# Altium schematic sheet CPU_ETH.SchDoc: Title
size 420 x 297 mm; Author: G.Kasprowicz; CompanyName: WUT ISE; DrawnBy: G.Kasprowicz; Organization: WUT ISE; Address1: PW ISE; Address2: Nowowiejska 15/19 00-665 Warsaw; Address3: gkasprow@gmail.com; DocumentNumber: 4; Revision: 2; SheetNumber: 4; SheetTotal: 18; ModifiedBy: -; CheckedDate: -; Title2: Title 2; DivGrp: WUT ISE; Designer: G.Kasprowicz; ModifiedDate: -; ProjectName: Sensor Box
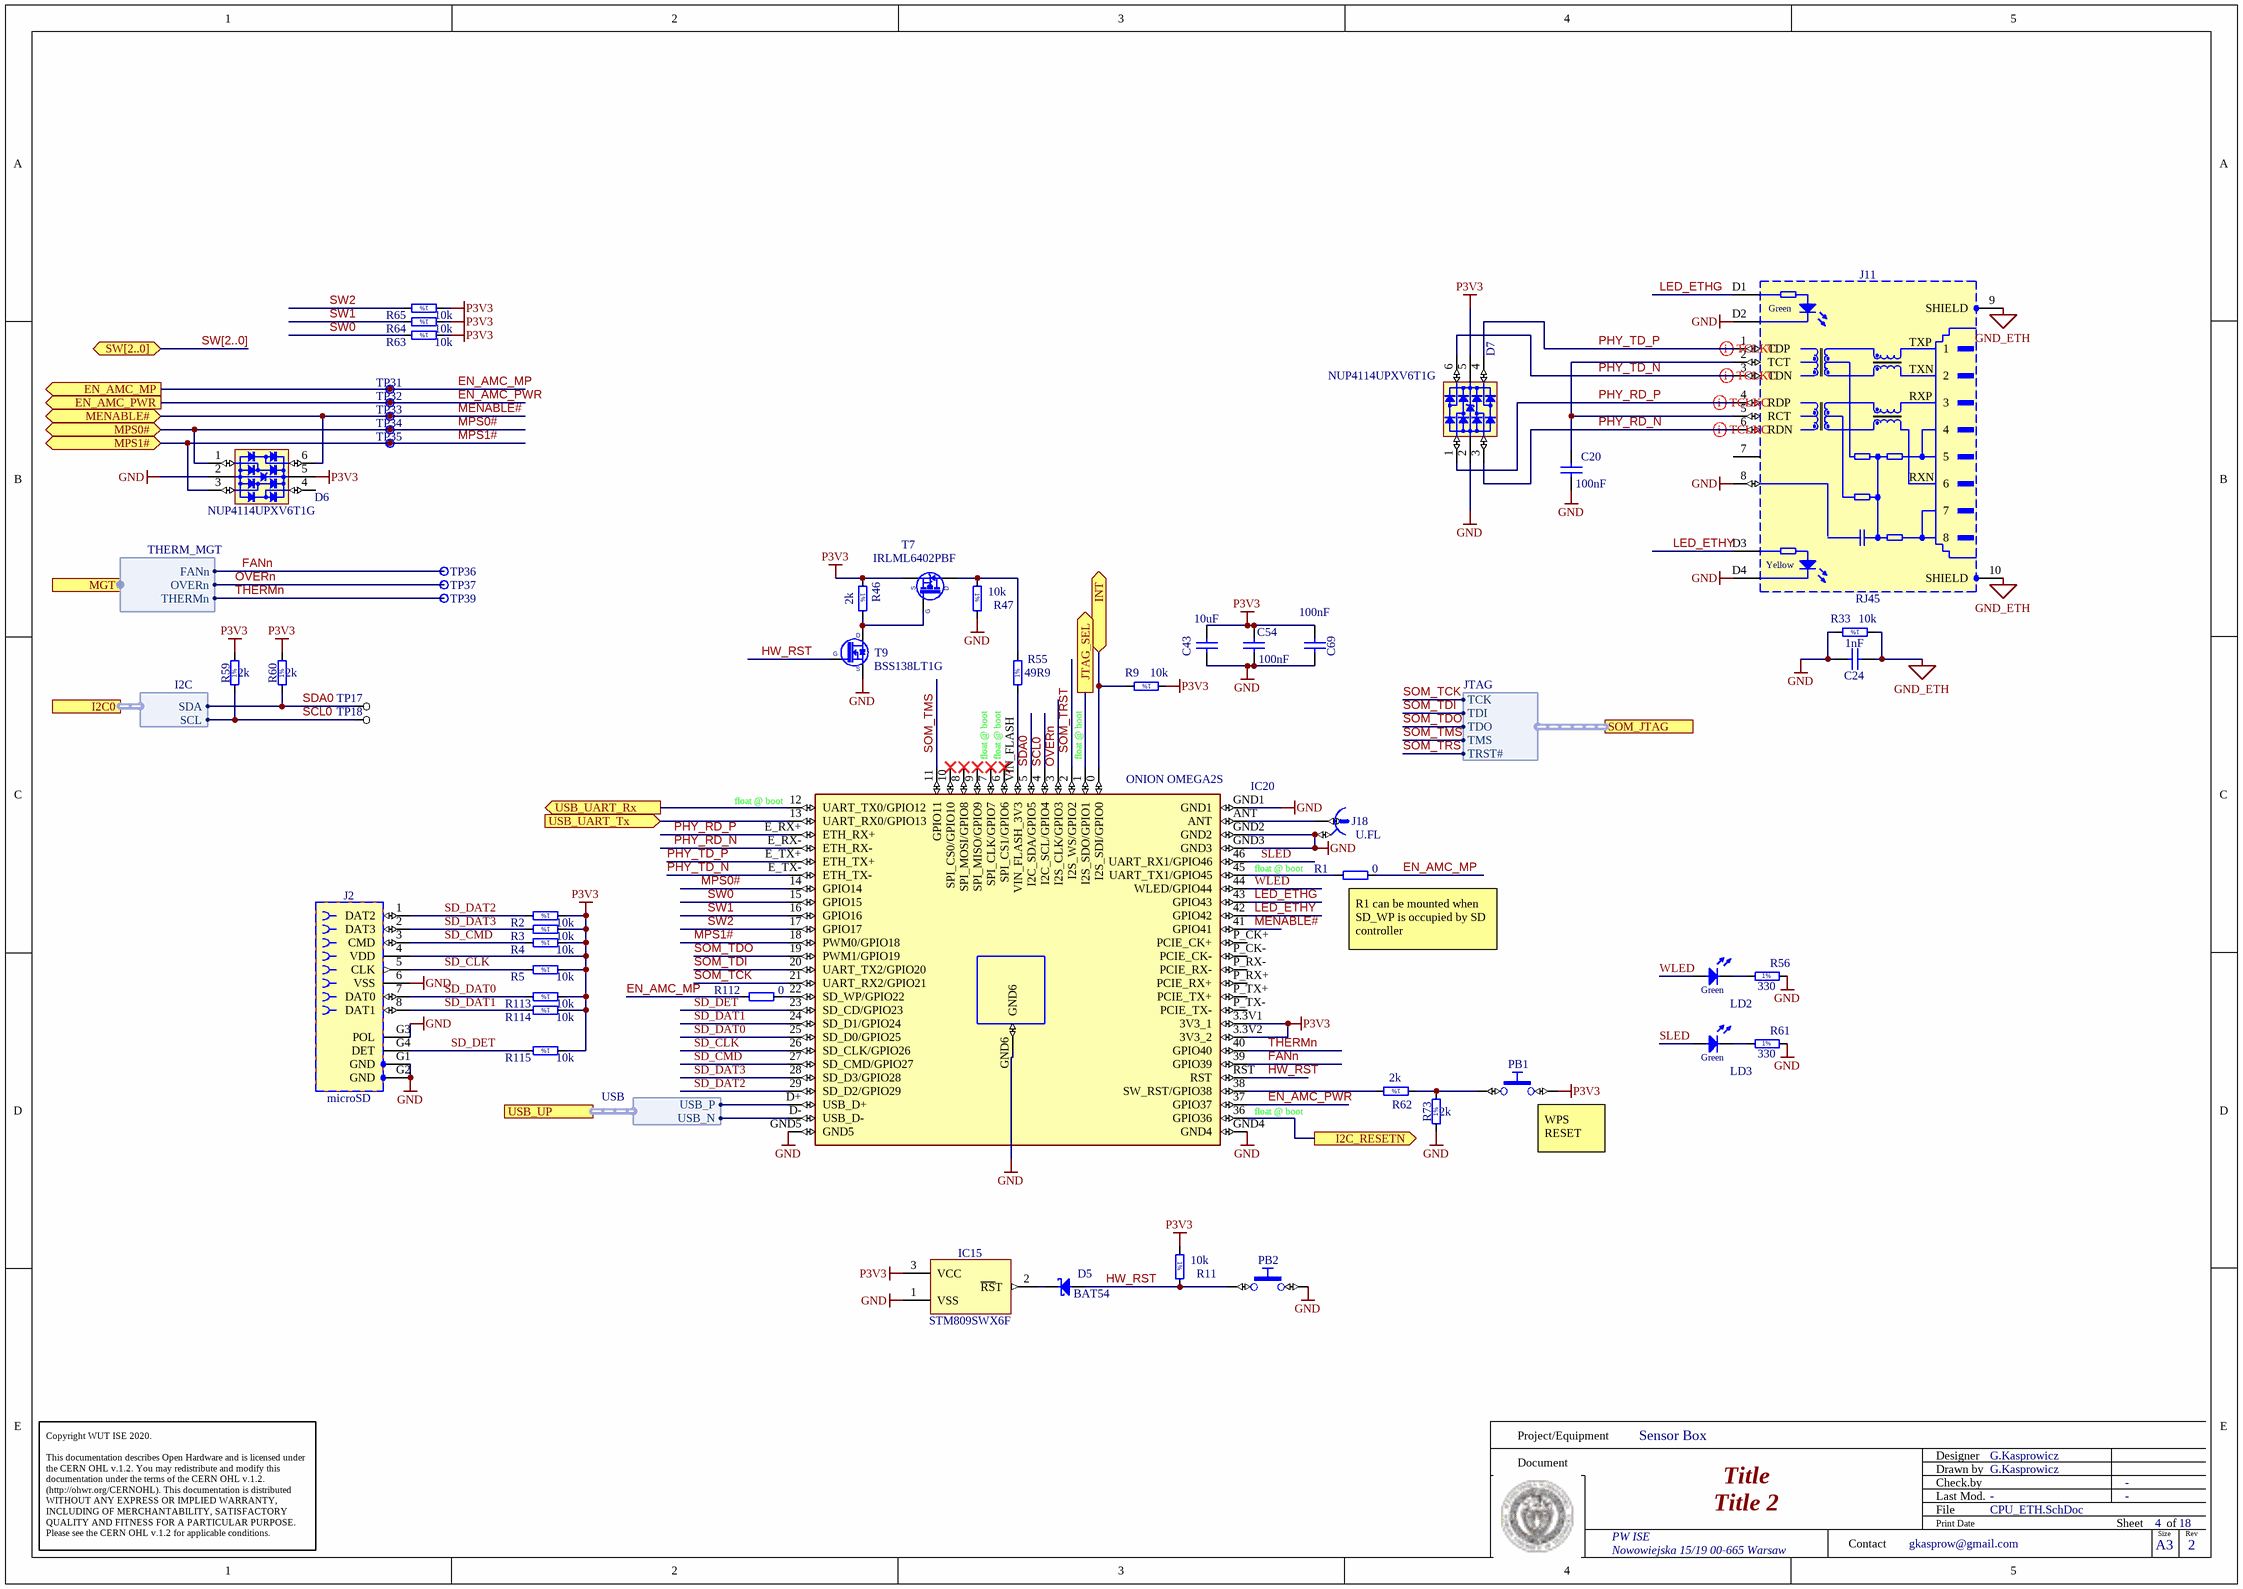
[diagram p0: CPU_ETH.SchDoc]

## Parts
C20  100nF  [CAPC1005X55N]
C24  1nF  [CAPC1005X55N]
C43  10uF  [CAPC2012X135N]
C54  100nF  [CAPC1005X55N]
C69  100nF  [CAPC1005X55N]
D5  BAT54  [SOT95P240X130-3N]
D6  NUP4114UPXV6T1G  [SOTFL50P160X60-6N]
D7  NUP4114UPXV6T1G  [SOTFL50P160X60-6N]
IC15  STM809SWX6F  [SOT95P237X112-3N]
IC20  ONION OMEGA2S  [OMEGA2S_PADS]
J2  microSD  [MOLEX_47309-2651]
J11  RJ45  [TYCO_5-6605308-1]
J18  U.FL  [HIROSE_U.FL-R-SMT-1(10)]
LD2  LED_AVAGO_HSME-C120  [LED_AVAGO_HSME-C120]  (value not drawn)
LD3  LED_AVAGO_HSME-C120  [LED_AVAGO_HSME-C120]  (value not drawn)
PB1  Push Button  [PB_TYCO_FSMSM]  (value not drawn)
PB2  Push Button  [PB_TYCO_FSMSM]  (value not drawn)
R1  0  [RESC1005X40N]
R2  10k  [RESC1005X40N]
R3  10k  [RESC1005X40N]
R4  10k  [RESC1005X40N]
R5  10k  [RESC1005X40N]
R9  10k  [RESC1005X40N]
R11  10k  [RESC1005X40N]
R33  10k  [RESC1005X40N]
R46  2k  [RESC1005X40N]
R47  10k  [RESC1005X40N]
R55  49R9  [RESC1005X40N]
R56  330  [RESC1608X55N]
R59  2k  [RESC1005X40N]
R60  2k  [RESC1005X40N]
R61  330  [RESC1608X55N]
R62  2k  [RESC1005X40N]
R63  10k  [RESC1005X40N]
R64  10k  [RESC1005X40N]
R65  10k  [RESC1005X40N]
R73  2k  [RESC1005X40N]
R112  0  [RESC1005X40N]
R113  10k  [RESC1005X40N]
R114  10k  [RESC1005X40N]
R115  10k  [RESC1005X40N]
T7  IRLML6402PBF  [SOT95P237X112-3N]
T9  BSS138LT1G  [SOT95P240X110-3N]
TP17  TP  [TP]  (value not drawn)
TP18  TP  [TP]  (value not drawn)
TP31  Test Point  [TPS127]  (value not drawn)
TP32  Test Point  [TPS127]  (value not drawn)
TP33  Test Point  [TPS127]  (value not drawn)
TP34  Test Point  [TPS127]  (value not drawn)
TP35  Test Point  [TPS127]  (value not drawn)
TP36  Test Point  [TPS127]  (value not drawn)
TP37  Test Point  [TPS127]  (value not drawn)
TP39  Test Point  [TPS127]  (value not drawn)

## Ports
EN_AMC_MP (out), EN_AMC_PWR (out), I2C0 (harness I2C), I2C_RESETN (out), INT (bidir), JTAG_SEL (out), MENABLE# (bidir), MGT (harness THERM_MGT), MPS0# (bidir), MPS1# (bidir), SOM_JTAG (harness JTAG), SW[2..0] (bidir), USB_UART_Rx (out), USB_UART_Tx (in), USB_UP (harness USB)

## Harnesses
THERM_MGT: OVERn, THERMn, FANn
I2C: SCL, SDA
JTAG: TCK, TDI, TDO, TMS, TRST#
USB: USB_N, USB_P

## Nets
GND: C20.1 C24.2 C43.2 C54.1 C69.1 D6.2(GND) D7.2(GND) IC15.1(VSS) IC20.GND1 IC20.GND2 IC20.GND3 IC20.GND4 IC20.GND5 IC20.GND6 J2.6(VSS) J2.G1(GND) J2.G2(GND) J2.G3(POL) J11.8 J11.D2 J11.D4 J18.2 PB2.2 R33.2 R47.2 R56.2 R61.2 R73.1 T9.2(S)
GND_ETH: C24.1 J11.9(SHIELD) J11.10(SHIELD) R33.1
P3V3: C43.1 C54.2 C69.2 D6.5(VBUS) D7.5(VBUS) IC15.3(VCC) IC20.3.3V1(3V3_1) IC20.3.3V2(3V3_2) J2.4(VDD) PB1.2 R2.1 R3.1 R4.1 R5.1 R9.1 R11.1 R46.1 R59.2 R60.2 R63.1 R64.1 R65.1 R113.1 R114.1 R115.1 T7.2(S)
EN_AMC_MP: R1.2 R112.1 TP31.1 ; port EN_AMC_MP
EN_AMC_PWR: IC20.37(GPIO37) TP32.1 ; port EN_AMC_PWR
FANn: IC20.39(GPIO39) TP36.1 ; port MGT.FANn
HW_RST: D5.1(A) IC20.RST PB2.1 R11.2 T9.1(G)
I2C_RESETN: IC20.36(GPIO36) ; port I2C_RESETN
INT: IC20.0(I2S_SDI/GPIO0) R9.2 ; port INT
JTAG_SEL: IC20.1(I2S_SDO/GPIO1) ; port JTAG_SEL
LED_ETHG: IC20.43(GPIO43) J11.D1
LED_ETHY: IC20.42(GPIO42) J11.D3
MENABLE#: D6.6(I/O4) IC20.41(GPIO41) TP33.1 ; port MENABLE#
MPS0#: D6.1(I/O1) IC20.14(GPIO14) TP34.1 ; port MPS0#
MPS1#: D6.3(I/O2) IC20.18(PWM0/GPIO18) TP35.1 ; port MPS1#
OVERn: IC20.3(I2S_CLK/GPIO3) TP37.1 ; port MGT.OVERn
PHY_RD_N: D7.3(I/O2) IC20.E_RX-(ETH_RX-) J11.6(RDN)
PHY_RD_P: D7.1(I/O1) IC20.E_RX+(ETH_RX+) J11.4(RDP)
PHY_TD_N: D7.6(I/O4) IC20.E_TX-(ETH_TX-) J11.3(TDN)
PHY_TD_P: D7.4(I/O3) IC20.E_TX+(ETH_TX+) J11.1(TDP)
SCL0: IC20.4(I2C_SCL/GPIO4) R59.1 TP18.1 ; port I2C0.SCL
SD_CLK: IC20.26(SD_CLK/GPIO26) J2.5(CLK) R5.2
SD_CMD: IC20.27(SD_CMD/GPIO27) J2.3(CMD) R4.2
SD_DAT0: IC20.25(SD_D0/GPIO25) J2.7(DAT0) R113.2
SD_DAT1: IC20.24(SD_D1/GPIO24) J2.8(DAT1) R114.2
SD_DAT2: IC20.29(SD_D2/GPIO29) J2.1(DAT2) R2.2
SD_DAT3: IC20.28(SD_D3/GPIO28) J2.2(DAT3) R3.2
SD_DET: IC20.23(SD_CD/GPIO23) J2.G4(DET) R115.2
SDA0: IC20.5(I2C_SDA/GPIO5) R60.1 TP17.1 ; port I2C0.SDA
SLED: IC20.46(UART_RX1/GPIO46) LD3.2(A)
SOM_TCK: IC20.21(UART_RX2/GPIO21) ; port SOM_JTAG.TCK
SOM_TDI: IC20.20(UART_TX2/GPIO20) ; port SOM_JTAG.TDI
SOM_TDO: IC20.19(PWM1/GPIO19) ; port SOM_JTAG.TDO
SOM_TMS: IC20.11(GPIO11) ; port SOM_JTAG.TMS
SOM_TRST: IC20.2(I2S_WS/GPIO2) ; port SOM_JTAG.TRST#
SW0: IC20.15(GPIO15) R63.2
SW1: IC20.16(GPIO16) R64.2
SW2: IC20.17(GPIO17) R65.2
THERMn: IC20.40(GPIO40) TP39.1 ; port MGT.THERMn
USB_UART_Rx: IC20.12(UART_TX0/GPIO12) ; port USB_UART_Rx
USB_UART_Tx: IC20.13(UART_RX0/GPIO13) ; port USB_UART_Tx
WLED: IC20.44(WLED/GPIO44) LD2.2(A)
NetC20_2: C20.2 J11.2(TCT) J11.5(RCT)
NetD5_3: D5.3(C) IC15.2(~{RS}T)
NetIC20_22: IC20.22(SD_WP/GPIO22) R112.2
NetIC20_38: IC20.38(SW_RST/GPIO38) R62.2
NetIC20_45: IC20.45(UART_TX1/GPIO45) R1.1
NetIC20_ANT: IC20.ANT J18.1
NetIC20_D+: IC20.D+(USB_D+) ; port USB_UP.USB_P
NetIC20_D-: IC20.D-(USB_D-) ; port USB_UP.USB_N
NetIC20_VIN_FLASH: IC20.VIN_FLASH(VIN_FLASH_3V3) R55.1
NetLD2_1: LD2.1(C) R56.1
NetLD3_1: LD3.1(C) R61.1
NetPB1_1: PB1.1 R62.1 R73.2
NetR46_2: R46.2 T7.1(G) T9.3(D)
NetR47_1: R47.1 R55.2 T7.3(D)

Not connected (* = marked no-connect by the designer): D6 4(I/O3); IC20 6(SPI_CS1/GPIO6)* 7(SPI_CLK/GPIO7)* 8(SPI_MOSI/GPIO8)* 9(SPI_MISO/GPIO9)* 10(SPI_CS0/GPIO10)* P_CK+(PCIE_CK+) P_CK-(PCIE_CK-) P_RX+(PCIE_RX+) P_RX-(PCIE_RX-) P_TX+(PCIE_TX+) P_TX-(PCIE_TX-); J11 7

## Buses and harness runs
bus SW[2..0] = port SW[2..0]

## Layout directives
differential pair: PHY_RD_N, PHY_RD_P, PHY_TD_N, PHY_TD_P

## Notes on the sheet
- (near IC20) float @ boot
- float @ boot
- (near R1) R1 can be mounted when SD_WP is occupied by SD controller
- (near PB1) WPS RESET
- Project/Equipment
- Document
- Designer
- Drawn by
- Check.by
- Copyright WUT ISE 2020.
  This documentation describes Open Hardware and is licensed under the CERN OHL v.1.2. You may redistribute and modify this documentation under the terms of the CERN OHL v.1.2. (http://ohwr.org/CERNOHL). This documentation is distributed WITHOUT ANY EXPRESS OR IMPLIED WARRANTY, INCLUDING OF MERCHANTABILITY, SATISFACTORY QUALITY AND FITNESS FOR A PARTICULAR PURPOSE. Please see the CERN OHL v.1.2 for applicable conditions.
- Contact
- File
- Last Mod.
- Print Date
- Sheet
- Size
- A3
- of
- Rev
- (in symbol R0402_2K_1%_0.0625W_100PPM) 1%
- (in symbol R0402_10K_1%_0.0625W_100PPM) 1%
- (in symbol R0402_49R9_1%_0.0625W_100PPM) 1%
- (in symbol R0603_330R_1%_0.1W_100PPM) 1%
- (in symbol TYCO_5-6605308-1) Green; TXP; TXN; RXP; RXN; Yellow

## Library data of the parts
C20 C54 C69 = CC0402_100NF_16V_10%_X5R: Non-polarised capacitor; Part Description: SMD Multilayer Chip Ceramic Capacitor; Manufacturer: GENERIC; Manufacturer1 Part Number: GRM155R61C104KA88D; Voltage: 16V; TC: X5R; Tolerance: ±10%; Part Number: CC0402_100NF_16V_10%_X5R; Component Kind: Standard; Component Type: Standard; Pin Count: 2; Value: 100nF; Status: None; Manufacturer Part Number: CC0402_100NF_16V_10%_X5R; Case: 0402; Mounted: Yes; Socket: No; SMD: Yes; Manufacturer1 Example: MURATA; Manufacturer1 ComponentHeight: 0.55mm; HelpURL: \\cern.ch\dfs\Applications\Altium\Datasheets\CC0402_X5R_MURATA_GRM.pdf; Author: CERN DEM JLC; CreateDate: 10.12.2013; LatestRevisionDate: 10.12.2013; Sense: No
C24 = CC0402_1NF_50V_10%_X7R: Non-polarised capacitor; Part Description: SMD Multilayer Chip Ceramic Capacitor; Manufacturer: GENERIC; Manufacturer1 Part Number: 223858715623; Voltage: 50V; TC: X7R; Tolerance: ±10%; Part Number: CC0402_1NF_50V_10%_X7R; Component Kind: Standard; Component Type: Standard; Pin Count: 2; Value: 1nF; Status: Not Recommended; Manufacturer Part Number: CC0402_1NF_50V_10%_X7R; Case: 0402; Mounted: Yes; Socket: No; SMD: Yes; Manufacturer1 Example: PHYCOMP; Manufacturer1 ComponentHeight: 0.55mm; HelpURL: \\cern.ch\dfs\Applications\Altium\Datasheets\CC0402_X7R_PHYCOMP.pdf; Author: CERN DEM JLC; CreateDate: 03.12.2007; LatestRevisionDate: 03.12.2007; Sense: No
C43 = CC0805_10UF_10V_10%_X7R: Non-polarised capacitor; Part Description: SMD Multilayer Chip Ceramic Capacitor; Manufacturer: GENERIC; Manufacturer1 Part Number: GRM21BR71A106KE51L; Voltage: 10V; TC: X7R; Tolerance: ±10%; Table: Capacitors SMD; Part Number: CC0805_10UF_10V_10%_X7R; Component Kind: Standard; Component Type: Standard; Pin Count: 2; Value: 10uF; Status: Preferred; Manufacturer Part Number: CC0805_10UF_10V_10%_X7R; Case: 0805; Mounted: Yes; Socket: No; SMD: Yes; Manufacturer1 Example: MURATA; Manufacturer1 ComponentHeight: 1.35mm; HelpURL: \\cern.ch\dfs\Applications\Altium\Datasheets\CC0805_X7R_MURATA.pdf; Author: CERN DEM JLC; CreateDate: 2012-04-30; LatestRevisionDate: 2012-04-30
D5 = BAT54: Diode Schottky  Anode Pin 1 Cathode Pin 3 (Pas de pin 2); Part Description: Single Small Signal Schottky Diode; Manufacturer: FAIRCHILD SEMICONDUCTOR; Voltage: 30V; Power: 200mA; Table: Diodes; Part Number: BAT54; Component Kind: Standard; Component Type: Standard; Device: BAT54; PackageDescription: SOT23 3-Leads, Pitch 0.95mm - Body 1.3x2.9mm, IPC Medium Density; Manufacturer Part Number: BAT54; Pin Count: 3; Case: SOT23-3; Mounted: Yes; Socket: No; SMD: Yes; ComponentHeight: 1.30mm; HelpURL: \\cern.ch\dfs\Applications\Altium\Datasheets\BAT54.pdf; Author: CERN DEM JLC; CreateDate: 2009-09-17; LatestRevisionDate: 2010-05-27
D6 D7 = NUP4114UPXV6T1G: Part Description: ESD Protection Diodes Array (8kV) with Low Clamping Voltage; Manufacturer: ON SEMICONDUCTOR; Voltage: 5.5V; PressFit: No; Bonding: No; Part Number: NUP4114UPXV6T1G; Component Kind: Standard; Component Type: Standard; Device: NUP4114UPXV6T1G; PackageDescription: SOTFL (SOT666, SOT563,), 0.50mm, Pitch; 6 Pin, 1.20mm W X 1.60mm L X 0.60mm H Body, IPC Medium Density; Manufacturer Part Number: NUP4114UPXV6T1G; Pin Count: 8; Mounted: Yes; Socket: No; SMD: Yes; Sense: No; ComponentHeight: 1.75mm; HelpURL: \\cern.ch\dfs\Applications\Altium\Datasheets\NUP4114UPXV6T1G.pdf; Author: CERN DEM JLC; CreateDate: 05.12.2012; LatestRevisionDate: 05.12.2012
IC15 = STM809SWX6F: 3-Pin Microprocessor Reset Circuit; Part Description: 3-Pin Microprocessor Reset Circuit, Reset Threshold Voltage 2.85-3.00V; Manufacturer: ST MICROELECTRONICS; PressFit: No; Bonding: No; Part Number: STM809SWX6F; Component Kind: Standard; Component Type: Standard; Device: STM809SWX6F; PackageDescription: SOT, 0.95mm, pitch; 3 pin,1.30mm W X 2.92mm L X 1.12mm H body, IPC Medium Density; Manufacturer Part Number: STM809SWX6F; Pin Count: 3; Case: SOT23; Mounted: Yes; Socket: No; SMD: Yes; Sense: No; ComponentHeight: 1.12mm; HelpURL: \\cern.ch\dfs\Applications\Altium\Datasheets\STM809SWX6F.pdf; Author: CERN DEM JMW; CreateDate: 11.08.2015; LatestRevisionDate: 11.08.2015
IC20 = MOD_OMEGA2S: MediaTek Transceiver; 802.11 b/g/n _Wi-Fi, WiFi, WLAN_ For Use With MT7688; MF: Onion; SnapEDA_Link: https://www.snapeda.com/parts/OMEGA2S/Onion/view-part/3600410/?ref=snap; MP: OMEGA2S; Price: None; Value: *; Availability: Unavailable; Package: Module Onion
J2 = MOLEX_47309-2651: MicroSD Card Header with Detect Switch; Part Description: 1.10mm Pitch microSD Card Header with Detect Switch; Manufacturer: MOLEX; PressFit: No; Part Number: MOLEX_47309-2651; Component Kind: Standard; Component Type: Standard; Pin Count: 12; Family: microSD; Mounted: Yes; Socket: No; SMD: Yes; Sense: No; Status: None; Manufacturer Part Number: 47309-2651; ComponentHeight: 2.65mm; HelpURL: \\cern.ch\dfs\Applications\Altium\Datasheets\MOLEX_47309-2651.pdf; Author: CERN DEM JMW; CreateDate: 29.06.2017; LatestRevisionDate: 29.06.2017
J11 = TYCO_5-6605308-1: 1 Port, Yellow/Green LEDs, RJ45 10/100Base-T Ethernet, Mag45 Connector Module With Integrated Magnetics; Manufacturer: TYCO ELECTRONICS; PressFit: No; Part Number: TYCO_5-6605308-1; Component Kind: Standard; Component Type: Standard; Pin Count: 14; Family: RJ45; Mounted: Yes; Socket: No; SMD: No; Sense: No; Status: None; Part Description: 1 Port, Yellow/Green LEDs, RJ45 10/100Base-T Ethernet, Mag45 Connector Module With Integrated Magnetics; Manufacturer Part Number: 5-6605308-1; ComponentHeight: 15.24mm; HelpURL: \\cern.ch\dfs\Applications\Altium\Datasheets\TYCO_5-6605308-1.pdf; Author: CERN DEM JLC; CreateDate: 23.08.2012; LatestRevisionDate: 23.08.2012
J18 = HIROSE_U.FL-R-SMT-1(10): Part Description: Up to 6GHz Ultra Small Surface Mount Male Coaxial Connectors U.FL Series; Manufacturer: HIROSE (HRS); PressFit: No; Part Number: HIROSE_U.FL-R-SMT-1(10); Component Kind: Standard; Component Type: Standard; Pin Count: 2; Family: U.FL; Mounted: Yes; Socket: No; SMD: Yes; Sense: No; Status: None; Manufacturer Part Number: U.FL-R-SMT-1(10); ComponentHeight: 1.25mm; HelpURL: \\cern.ch\dfs\Applications\Altium\Datasheets\HIROSE_U.FL-R-SMT-1(10).pdf; Author: CERN DEM JLC; CreateDate: 24.03.2010; LatestRevisionDate: 24.03.2010
LD2 LD3 = LED_AVAGO_HSME-C120: LED Green 1C 2A; Part Description: High Performance Right Angle Chip Green LED; Manufacturer: AVAGO TECHNOLOGIES; Table: LEDs & Displays; Part Number: LED_AVAGO_HSME-C120; Component Kind: Standard; Component Type: Standard; Color: Green; PackageDescription: Green Chip LED, 2-Leads, Body 1.7x1.1mm, Side Emitting Package; Manufacturer Part Number: HSME-C120; Pin Count: 2; Mounted: Yes; Socket: No; SMD: Yes; ComponentHeight: 0.7mm; HelpURL: \\cern.ch\dfs\Applications\Altium\Datasheets\LED_AVAGO_HSME-C120.pdf; ComponentLink1URL: \\cern.ch\dfs\Applications\Altium\Datasheets\LED_AVAGO_HSME-C110_DESIGN-GUIDE.pdf; ComponentLink1Description: Design Guide; Author: CERN DEM JMW; CreateDate: 2009-07-22; LatestRevisionDate: 2012-06-20
PB1 PB2 = PB_TYCO_FSMSM: Push-Button Switch SPDT; Part Description: 12VDC 50mA SPST Tactile  Push-Button Switch; Manufacturer: TYCO ELECTRONICS; Manufacturer Part Number: FSMSM or 1437566-3; PressFit: No; Part Number: PB_TYCO_FSMSM; Component Kind: Standard; Component Type: Standard; Pin Count: 2; PackageDescription: Body 3.5x6.0mm, Pushbutton Switch,  TYCO ALCOSWITCH FSMSM Serie; Family: Push Button; Mounted: Yes; Socket: No; SMD: Yes; Sense: No; Status: None; ComponentHeight: 4.3mm; HelpURL: \\cern.ch\dfs\Applications\Altium\Datasheets\PB_TYCO_FSMSM.pdf; Author: CERN DEM JLC; CreateDate: 30.06.2008; LatestRevisionDate: 21.06.2012
R1 R112 = R0402_0R_JUMPER: Resistor; Part Description: 1A (0.05R Max DC Resistance) Zero Ohm Jumper; Manufacturer: GENERIC; Manufacturer1 Part Number: 232270591001L; PressFit: No; Part Number: R0402_0R_JUMPER; Component Kind: Standard; Component Type: Standard; Pin Count: 2; Value: 0; Status: Not Recommended; Manufacturer Part Number: R0402_0R_JUMPER; Case: 0402; Mounted: Yes; Socket: No; SMD: Yes; Manufacturer1 Example: YAGEO PHYCOMP; Manufacturer1 ComponentHeight: 0.4mm; HelpURL: \\cern.ch\dfs\Applications\Altium\Datasheets\R0402_Phycomp_RC0402.pdf; Author: CERN DEM JLC; CreateDate: 03.12.2007; LatestRevisionDate: 17.10.2012; Sense: No
R2-R5 R9 R11 R33 R47 R63-R65 R113-R115 = R0402_10K_1%_0.0625W_100PPM: Resistor - 1%; Part Description: General Purpose Thick Film Chip Resistor; Manufacturer: GENERIC; Manufacturer1 Part Number: 232270671003L; TC: ±100ppm/°C; Table: Resistors SMD; Part Number: R0402_10K_1%_0.0625W_100PPM; Component Kind: Standard; Component Type: Standard; Pin Count: 2; Value: 10k; Status: Not recommended; Power: 0.0625W; Tolerance: ±1%; Manufacturer Part Number: R0402_10K_1%_0.0625W_100PPM; Case: 0402; Mounted: Yes; Socket: No; SMD: Yes; Manufacturer1 Example: YAGEO PHYCOMP; Manufacturer1 ComponentHeight: 0.4mm; HelpURL: \\cern.ch\dfs\Applications\Altium\Datasheets\R0402_Phycomp_RC0402.pdf; Author: CERN DEM JLC; CreateDate: 2007-12-03; LatestRevisionDate: 2012-10-17
R46 R59 R60 R62 R73 = R0402_2K_1%_0.0625W_100PPM: Resistor - 1%; Part Description: General Purpose Thick Film Chip Resistor; Manufacturer: GENERIC; Manufacturer1 Part Number: 232270672002L; TC: ±100ppm/°C; PressFit: No; Part Number: R0402_2K_1%_0.0625W_100PPM; Component Kind: Standard; Component Type: Standard; Pin Count: 2; Value: 2k; Status: Not Recommended; Power: 0.0625W; Tolerance: ±1%; Manufacturer Part Number: R0402_2K_1%_0.0625W_100PPM; Case: 0402; Mounted: Yes; Socket: No; SMD: Yes; Manufacturer1 Example: YAGEO PHYCOMP; Manufacturer1 ComponentHeight: 0.4mm; HelpURL: \\cern.ch\dfs\Applications\Altium\Datasheets\R0402_Phycomp_RC0402.pdf; Author: CERN DEM JLC; CreateDate: 03.12.2007; LatestRevisionDate: 17.10.2012; Sense: No
R55 = R0402_49R9_1%_0.0625W_100PPM: Resistor - 1%; Part Description: General Purpose Thick Film Chip Resistor; Manufacturer: GENERIC; Manufacturer1 Part Number: 232270674999L or RC0402FR-0749R9L; TC: ±100ppm/°C; Table: Resistors SMD; Part Number: R0402_49R9_1%_0.0625W_100PPM; Component Kind: Standard; Component Type: Standard; Pin Count: 2; Value: 49R9; Status: Not recommended; Power: 0.0625W; Tolerance: ±1%; Manufacturer Part Number: R0402_49R9_1%_0.0625W_100PPM; Case: 0402; Mounted: Yes; Socket: No; SMD: Yes; Manufacturer1 Example: YAGEO PHYCOMP; Manufacturer1 ComponentHeight: 0.4mm; HelpURL: \\cern.ch\dfs\Applications\Altium\Datasheets\R0402_Phycomp_RC0402.pdf; Author: CERN DEM JLC; CreateDate: 2012-10-24; LatestRevisionDate: 2012-10-24
R56 R61 = R0603_330R_1%_0.1W_100PPM: Resistor - 1%; Part Description: General Purpose Thick Film Chip Resistor; Manufacturer: GENERIC; Manufacturer1 Part Number: NRC06F3300TRF; Power: 0.1W; TC: ±100ppm/°C; Table: Resistors SMD; Part Number: R0603_330R_1%_0.1W_100PPM; Component Kind: Standard; Component Type: Standard; Pin Count: 2; Value: 330; Status: Preferred; Tolerance: ±1%; Manufacturer Part Number: R0603_330R_1%_0.1W_100PPM; Case: 0603; Mounted: Yes; Socket: No; SMD: Yes; Manufacturer1 Example: NIC COMPONENT; Manufacturer1 ComponentHeight: 0.55mm; HelpURL: \\cern.ch\dfs\Applications\Altium\Datasheets\R0603_NIC_NRC.pdf; Author: CERN DEM JLC; CreateDate: 2007-12-03; LatestRevisionDate: 2008-03-13
T7 = IRLML6402PBF: P-CHANNEL MOSFET WITH ZENER DIODE; Part Description: -20V -3.7A P-Channel HEXFET® Power MOSFET; Manufacturer: INTERNATIONAL RECTIFIER; PressFit: No; Bonding: No; Part Number: IRLML6402PBF; Component Kind: Standard; Component Type: Standard; Device: IRLML6402PBF; PackageDescription: SOT, 0.95mm, pitch; 3 pin,1.30mm W X 2.92mm L X 1.12mm H body, IPC Medium Density; Manufacturer Part Number: IRLML6402PBF; Pin Count: 3; Case: SOT23-3; Mounted: Yes; Socket: No; SMD: Yes; Sense: No; ComponentHeight: 1.12mm; HelpURL: \\cern.ch\dfs\Applications\Altium\Datasheets\IRLML6402PBF.pdf; Author: CERN DEM JLC; CreateDate: 8/29/2011; LatestRevisionDate: 8/29/2011
T9 = BSS138LT1G: N-CHANNEL MOSFET WITH DIODE; Part Description: 50V 200mA N-Channel Enhancement Mode Field-Effect Transistor; Manufacturer: ON SEMICONDUCTOR; PressFit: No; Bonding: No; Part Number: BSS138LT1G; Component Kind: Standard; Component Type: Standard; Device: BSS138LT1G; PackageDescription: SOT23 3-Leads, Pitch 0.95mm - Body 1.4x3mm, IPC Medium Density; Manufacturer Part Number: BSS138LT1G; Pin Count: 3; Case: SOT23-3; Mounted: Yes; Socket: No; SMD: Yes; Sense: No; ComponentHeight: 1.11mm; HelpURL: \\cern.ch\dfs\Applications\Altium\Datasheets\BSS138LT1G.pdf; Author: CERN DEM JLC; CreateDate: 3/23/2009; LatestRevisionDate: 3/23/2009
TP17 TP18 = TP: Testpoint
TP31-TP37 TP39 = SMD_PAD_1.27X1.27MM: Part Description: 1.27mm x 1.27mm PCB Copper Area (SMD Test Point); Mounted: No; Part Number: SMD_PAD_1.27X1.27MM; Component Kind: Standard (No BOM); Component Type: Standard (No BOM); Pin Count: 1; Family: Test Point; Socket: No; SMD: Yes; Sense: No; Status: None; ComponentHeight: 0mm; HelpURL: Undefined; Author: CERN DEM JLC; CreateDate: 12.01.2008; LatestRevisionDate: 12.01.2008; PackageDescription: 1.27mm x 1.27mm PCB Copper Area (SMD Test Point)